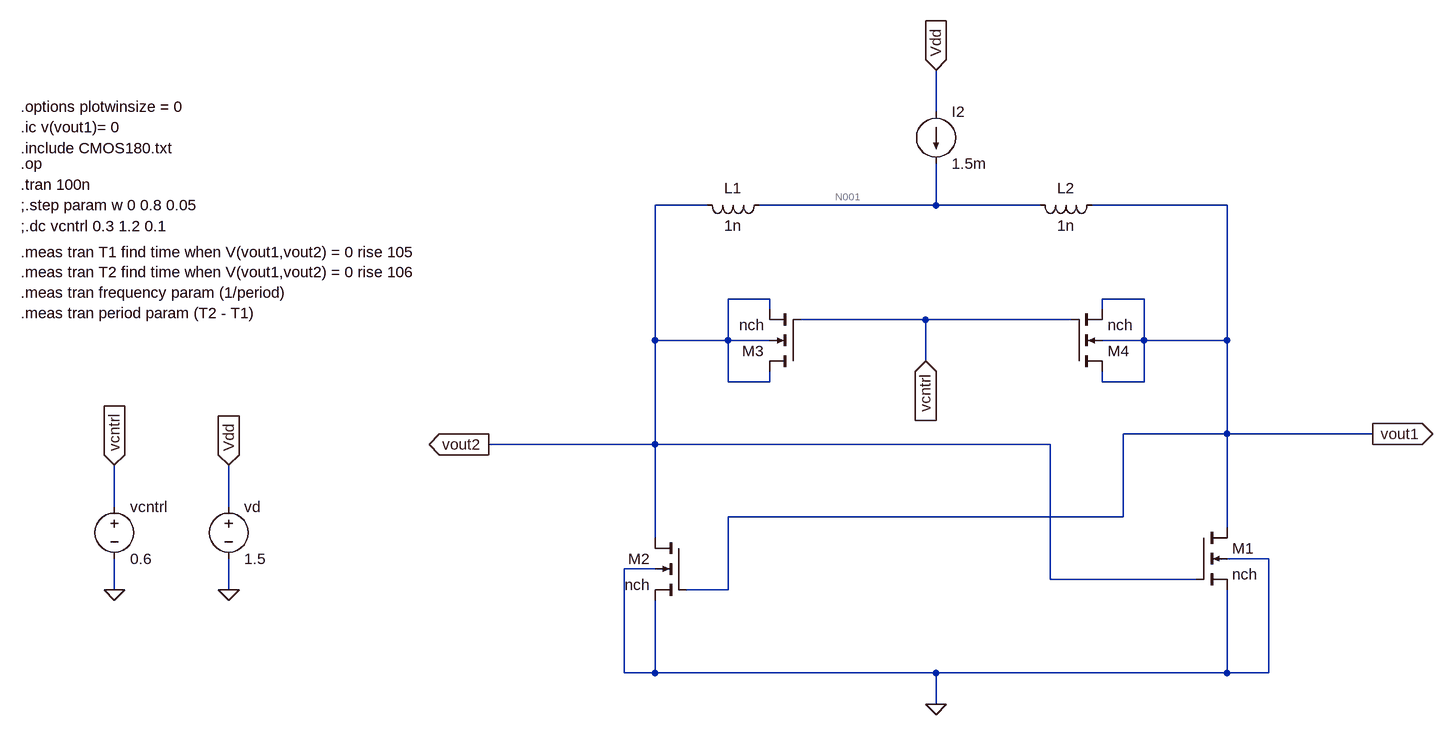
[diagram p0: schematic VCO_PositiveK.asc]
VCO_PositiveK.asc, the LTspice schematic file:
Version 4
SHEET 1 5428 1300
WIRE 672 -640 672 -704
WIRE 320 -496 240 -496
WIRE 672 -496 672 -560
WIRE 672 -496 400 -496
WIRE 832 -496 672 -496
WIRE 1120 -496 912 -496
WIRE 416 -352 352 -352
WIRE 992 -352 928 -352
WIRE 416 -336 416 -352
WIRE 928 -336 928 -352
WIRE 656 -320 464 -320
WIRE 880 -320 656 -320
WIRE 240 -288 240 -496
WIRE 352 -288 352 -352
WIRE 352 -288 240 -288
WIRE 416 -288 352 -288
WIRE 992 -288 992 -352
WIRE 992 -288 928 -288
WIRE 1120 -288 1120 -496
WIRE 1120 -288 992 -288
WIRE 656 -256 656 -320
WIRE 352 -224 352 -288
WIRE 416 -224 416 -240
WIRE 416 -224 352 -224
WIRE 928 -224 928 -240
WIRE 992 -224 992 -288
WIRE 992 -224 928 -224
WIRE 1120 -144 1120 -288
WIRE 1120 -144 960 -144
WIRE 1344 -144 1120 -144
WIRE 240 -128 240 -288
WIRE 240 -128 -16 -128
WIRE 848 -128 240 -128
WIRE -592 -32 -592 -96
WIRE -416 -32 -416 -96
WIRE 960 -16 960 -144
WIRE 960 -16 352 -16
WIRE 1120 0 1120 -144
WIRE 240 16 240 -128
WIRE 1184 48 1120 48
WIRE 240 64 192 64
WIRE 848 80 848 -128
WIRE 1072 80 848 80
WIRE -592 96 -592 48
WIRE -416 96 -416 48
WIRE 352 96 352 -16
WIRE 352 96 288 96
WIRE 192 224 192 64
WIRE 240 224 240 112
WIRE 240 224 192 224
WIRE 672 224 240 224
WIRE 1120 224 1120 96
WIRE 1120 224 672 224
WIRE 1184 224 1184 48
WIRE 1184 224 1120 224
WIRE 672 272 672 224
FLAG -416 96 0
FLAG 672 -704 Vdd
IOPIN 672 -704 In
FLAG -416 -96 Vdd
IOPIN -416 -96 In
FLAG 1344 -144 vout1
IOPIN 1344 -144 Out
FLAG 672 272 0
FLAG -16 -128 vout2
IOPIN -16 -128 Out
FLAG -592 96 0
FLAG -592 -96 vcntrl
IOPIN -592 -96 In
FLAG 656 -256 vcntrl
IOPIN 656 -256 In
SYMBOL voltage -416 -48 R0
WINDOW 123 0 0 Left 0
WINDOW 39 0 0 Left 0
SYMATTR InstName vd
SYMATTR Value 1.5
SYMBOL nmos4 288 16 M0
SYMATTR Value2 l=0.36u w=153.8u
SYMATTR InstName M2
SYMATTR Value nch
SYMBOL current 672 -640 R0
WINDOW 123 0 0 Left 0
WINDOW 39 0 0 Left 0
SYMATTR InstName I2
SYMATTR Value 1.5m
SYMBOL ind 416 -512 R90
WINDOW 0 5 56 VBottom 2
WINDOW 3 32 56 VTop 2
SYMATTR InstName L1
SYMATTR Value 1n
SYMATTR SpiceLine Rser=1.5
SYMBOL nmos4 1072 0 R0
SYMATTR Value2 l=0.36u w=153.8u
SYMATTR InstName M1
SYMATTR Value nch
SYMBOL voltage -592 -48 R0
WINDOW 123 0 0 Left 0
WINDOW 39 0 0 Left 0
SYMATTR InstName vcntrl
SYMATTR Value 0.6
SYMBOL ind 928 -512 R90
WINDOW 0 5 56 VBottom 2
WINDOW 3 32 56 VTop 2
SYMATTR InstName L2
SYMATTR Value 1n
SYMATTR SpiceLine Rser=1.5
SYMBOL nmos4 464 -240 R180
SYMATTR Value2 l=0.36u w=31u m=60
SYMATTR InstName M3
SYMATTR Value nch
SYMBOL nmos4 880 -240 M180
SYMATTR Value2 l=0.36u w=31u m=60
SYMATTR InstName M4
SYMATTR Value nch
TEXT -736 -584 Left 2 !.include CMOS180.txt
TEXT -736 -560 Left 2 !.op
TEXT -736 -528 Left 2 !.tran 100n
TEXT -736 -616 Left 2 !.ic v(vout1)= 0
TEXT -736 -648 Left 2 !.options plotwinsize = 0
TEXT -736 -496 Left 2 !;.step param w 0 0.8 0.05
TEXT -736 -464 Left 2 !;.dc vcntrl 0.3 1.2 0.1
TEXT -736 -424 Left 2 !.meas tran T1 find time when V(vout1,vout2) = 0 rise 105\n.meas tran T2 find time when V(vout1,vout2) = 0 rise 106\n.meas tran frequency param (1/period)\n.meas tran period param (T2 - T1)

The netlist it stands for:
* VCO_PositiveK.asc
vd Vdd 0 1.5
M2 vout2 vout1 0 0 nch l=0.36u w=153.8u
I2 Vdd N001 1.5m
L1 N001 vout2 1n Rser=1.5
M1 vout1 vout2 0 0 nch l=0.36u w=153.8u
vcntrl vcntrl 0 0.6
L2 vout1 N001 1n Rser=1.5
M3 vout2 vcntrl vout2 vout2 nch l=0.36u w=31u m=60
M4 vout1 vcntrl vout1 vout1 nch l=0.36u w=31u m=60
.model NMOS NMOS
.model PMOS PMOS
.lib standard.mos
.include CMOS180.txt
.op
.tran 100n
.ic v(vout1)= 0
.options plotwinsize = 0
;.step param w 0 0.8 0.05
;.dc vcntrl 0.3 1.2 0.1
.meas tran T1 find time when V(vout1,vout2) = 0 rise 105
.meas tran T2 find time when V(vout1,vout2) = 0 rise 106
.meas tran frequency param (1/period)
.meas tran period param (T2 - T1)
.backanno
.end

* Results of the author's LTspice run, read from the files saved beside the schematic
* Operating Point, zero values left out:
*   V(vdd) = 1.5 V
*   V(vout2) = 2.247 mV
*   V(n001) = 2.247 mV
*   V(vcntrl) = 600 mV
*   Id(M2) = 29.29 pA
*   Is(M2) = -29.28 pA
*   I(L2) = -1.5 mA
*   I(L1) = 29.29 pA
*   I(I2) = 1.5 mA
*   I(Vd) = -1.5 mA
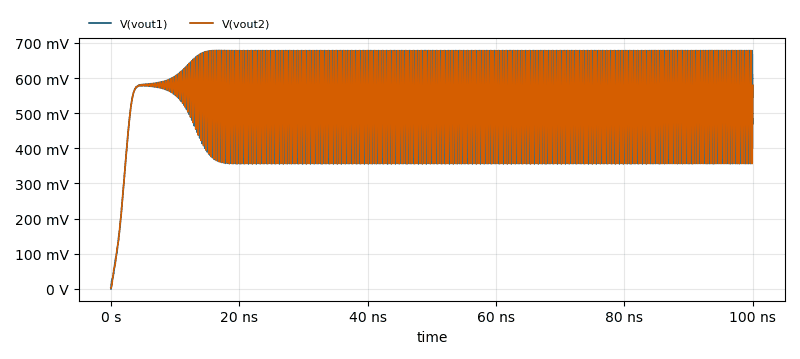
[diagram p1: Transient Analysis of VCO_PositiveK.asc, plotted from the saved traces]
* Transient Analysis, 1 run:
*   V(vout1): min 0 V, max 678.7 mV, average 517.4 mV, rms 531.4 mV, last 471.1 mV
*   V(vout2): min 2.247 mV, max 678.9 mV, average 517.2 mV, rms 531.3 mV, last 579.2 mV
* From the log:
*   t1: time=4.24145e-008 at 4.24145e-008
*   t2: time=4.28154e-008 at 4.28154e-008
*   frequency: (1/period)=2.49405e+009
*   period: (t2 - t1)=4.00954e-010